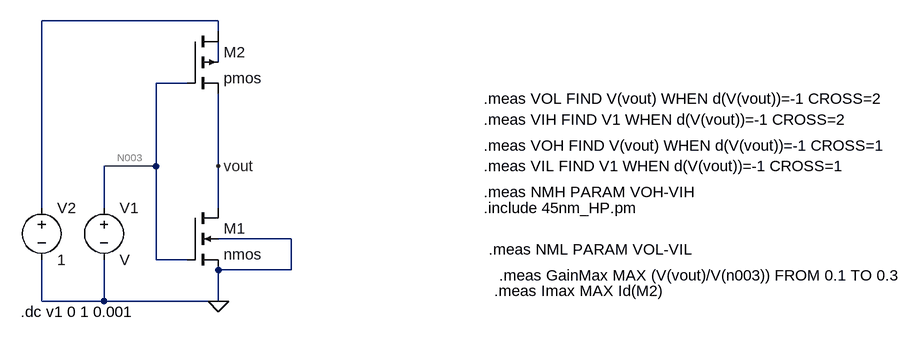
[diagram p0: schematic 45_switching.asc]
45_switching.asc, the LTspice schematic file:
Version 4
SHEET 1 1316 680
WIRE 224 -272 -48 -272
WIRE 224 -256 224 -272
WIRE 224 -208 224 -240
WIRE 176 -176 128 -176
WIRE 128 -48 128 -176
WIRE 128 -48 48 -48
WIRE 224 -48 224 -160
WIRE -48 16 -48 -272
WIRE 48 16 48 -48
WIRE 224 16 224 -48
WIRE 336 64 224 64
WIRE 128 96 128 -48
WIRE 176 96 128 96
WIRE 336 112 336 64
WIRE 336 112 224 112
WIRE -48 160 -48 96
WIRE 48 160 48 96
WIRE 48 160 -48 160
WIRE 224 160 224 112
WIRE 224 160 48 160
FLAG 224 -48 vout
FLAG 224 160 0
SYMBOL voltage 48 0 R0
SYMATTR InstName V1
SYMBOL voltage -48 0 R0
WINDOW 123 0 0 Left 0
WINDOW 39 0 0 Left 0
SYMATTR InstName V2
SYMATTR Value 1
SYMBOL cmosp 176 -256 R0
SYMATTR InstName M2
SYMATTR Value pmos
SYMATTR Value2 l=45n w=90n ad=0.0081p as=0.0081p pd=360n ps=360n
SYMBOL cmosn 176 16 R0
SYMATTR InstName M1
SYMATTR Value nmos
SYMATTR Value2 l=45n w=90n ad=0.0081p as=0.0081p pd=360n ps=460n
TEXT -80 176 Left 2 !.dc v1 0 1 0.001
TEXT 632 16 Left 2 !.include 45nm_HP.pm
TEXT 632 -48 Left 2 !.meas VIL FIND V1 WHEN d(V(vout))=-1 CROSS=1
TEXT 632 -80 Left 2 !.meas VOH FIND V(vout) WHEN d(V(vout))=-1 CROSS=1
TEXT 632 -152 Left 2 !.meas VOL FIND V(vout) WHEN d(V(vout))=-1 CROSS=2
TEXT 632 -120 Left 2 !.meas VIH FIND V1 WHEN d(V(vout))=-1 CROSS=2
TEXT 632 -8 Left 2 !.meas NMH PARAM VOH-VIH
TEXT 640 80 Left 2 !.meas NML PARAM VOL-VIL
TEXT 648 144 Left 2 !.meas Imax MAX Id(M2)
TEXT 656 120 Left 2 !.meas GainMax MAX (V(vout)/V(n003)) FROM 0.1 TO 0.3

The netlist it stands for:
* 45_switching.asc
V1 N003 0 V
V2 N001 0 1
M2 N001 N003 vout N002 pmos l=45n w=90n ad=0.0081p as=0.0081p pd=360n ps=360n
M1 vout N003 0 0 nmos l=45n w=90n ad=0.0081p as=0.0081p pd=360n ps=460n
.model NMOS NMOS
.model PMOS PMOS
.lib standard.mos
.dc v1 0 1 0.001
.include 45nm_HP.pm
.meas VIL FIND V1 WHEN d(V(vout))=-1 CROSS=1
.meas VOH FIND V(vout) WHEN d(V(vout))=-1 CROSS=1
.meas VOL FIND V(vout) WHEN d(V(vout))=-1 CROSS=2
.meas VIH FIND V1 WHEN d(V(vout))=-1 CROSS=2
.meas NMH PARAM VOH-VIH
.meas NML PARAM VOL-VIL
.meas Imax MAX Id(M2)
.meas GainMax MAX (V(vout)/V(n003)) FROM 0.1 TO 0.3
.backanno
.end

* Results of the author's LTspice run, read from the files saved beside the schematic
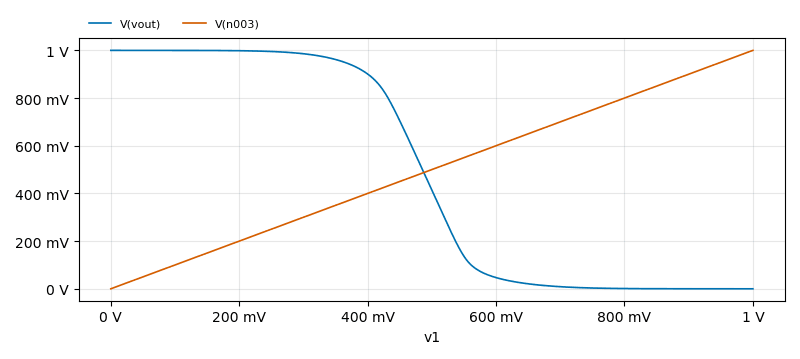
[diagram p1: DC transfer characteristic of 45_switching.asc, plotted from the saved traces]
* DC transfer characteristic, 1 run:
*   V(vout): 1 V at v1=0 V, 7.867 µV at v1=1 V, min 7.867 µV, max 1 V
*   V(n003): 0 V at v1=0 V, 1 V at v1=1 V, min 0 V, max 1 V
* From the log:
*   vil: v1=0.367063 at 0.367063
*   voh: v(vout)=0.94712 at 0.367063
*   vol: v(vout)=0.0566549 at 0.588946
*   vih: v1=0.588946 at 0.588946
*   nmh: voh-vih=0.358174
*   nml: vol-vil=-0.310408
*   imax: MAX(id(m2))=1.18648e-05 FROM 0 TO 1
*   gainmax: MAX(v(vout)/v(n003))=9.9989 FROM 0.1 TO 0.3